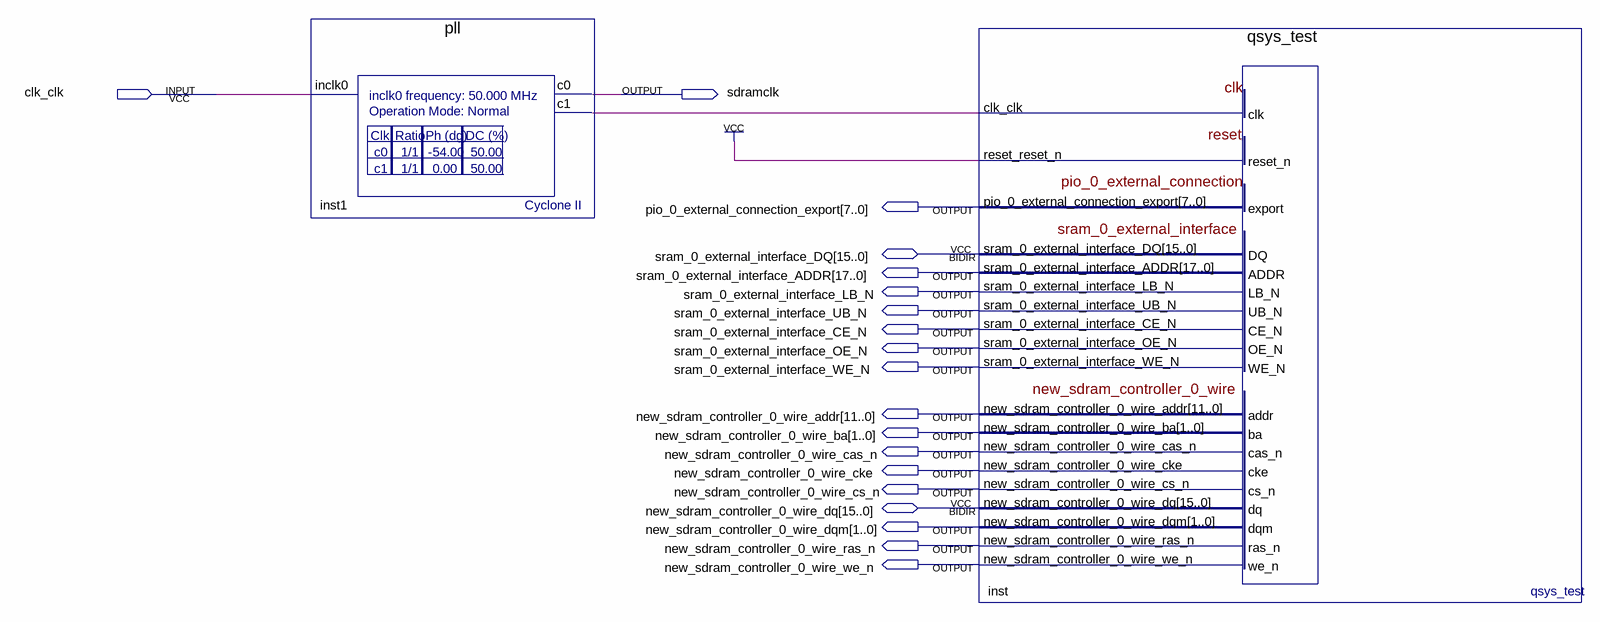
[diagram p0: schematic sheet]
// Quartus schematic part_a.bdf as structural Verilog: 2 symbols, 19 pins
module part_a (
  input  clk_clk,
  inout  [15:0] sram_0_external_interface_DQ,
  inout  [15:0] new_sdram_controller_0_wire_dq,
  output sdramclk,
  output [7:0] pio_0_external_connection_export,
  output [17:0] sram_0_external_interface_ADDR,
  output sram_0_external_interface_LB_N,
  output sram_0_external_interface_UB_N,
  output sram_0_external_interface_CE_N,
  output sram_0_external_interface_OE_N,
  output sram_0_external_interface_WE_N,
  output [11:0] new_sdram_controller_0_wire_addr,
  output [1:0] new_sdram_controller_0_wire_ba,
  output new_sdram_controller_0_wire_cas_n,
  output new_sdram_controller_0_wire_cke,
  output new_sdram_controller_0_wire_cs_n,
  output [1:0] new_sdram_controller_0_wire_dqm,
  output new_sdram_controller_0_wire_ras_n,
  output new_sdram_controller_0_wire_we_n
);

  wire inst1_c1;

  pll inst1 (.inclk0(clk_clk), .c0(sdramclk), .c1(inst1_c1));
  qsys_test inst (
    .clk_clk(inst1_c1), .reset_reset_n(1'b1),
    .pio_0_external_connection_export(pio_0_external_connection_export),
    .sram_0_external_interface_ADDR(sram_0_external_interface_ADDR),
    .sram_0_external_interface_LB_N(sram_0_external_interface_LB_N),
    .sram_0_external_interface_UB_N(sram_0_external_interface_UB_N),
    .sram_0_external_interface_CE_N(sram_0_external_interface_CE_N),
    .sram_0_external_interface_OE_N(sram_0_external_interface_OE_N),
    .sram_0_external_interface_WE_N(sram_0_external_interface_WE_N),
    .new_sdram_controller_0_wire_addr(new_sdram_controller_0_wire_addr),
    .new_sdram_controller_0_wire_ba(new_sdram_controller_0_wire_ba),
    .new_sdram_controller_0_wire_cas_n(new_sdram_controller_0_wire_cas_n),
    .new_sdram_controller_0_wire_cke(new_sdram_controller_0_wire_cke),
    .new_sdram_controller_0_wire_cs_n(new_sdram_controller_0_wire_cs_n),
    .new_sdram_controller_0_wire_dqm(new_sdram_controller_0_wire_dqm),
    .new_sdram_controller_0_wire_ras_n(new_sdram_controller_0_wire_ras_n),
    .new_sdram_controller_0_wire_we_n(new_sdram_controller_0_wire_we_n),
    .sram_0_external_interface_DQ(sram_0_external_interface_DQ),
    .new_sdram_controller_0_wire_dq(new_sdram_controller_0_wire_dq));
endmodule
